# EAGLE schematic OES_Small v10 (EAGLE 9.7.0)
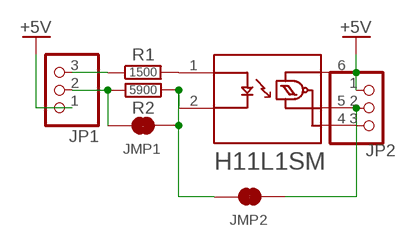
[diagram p0: schematic, sheet 1]

## Parts
JMP1  JUMPER-SMT_2_NC_TRACE_NO-SILK  [SMT-JUMPER_2_NC_TRACE_NO-SILK]
JMP2  JUMPER-SMT_2_NC_TRACE_NO-SILK  [SMT-JUMPER_2_NC_TRACE_NO-SILK]
JP1  PINHD-1X3  [1X03]
JP2  PINHD-1X3  [1X03]
R1  1500  R_CHIP-0402(1005-METRIC)  [RESC1005X40]
R2  5900  R_CHIP-0402(1005-METRIC)  [RESC1005X40]
U1  H11L1SM  [IC_H11L1SM]

## Nets
+5V: JP1.1 JP2.1 U1.6(VCC)
N$1: R1.2 U1.1(A)
N$2: JMP2.1 JP2.2 U1.5(GND)
N$3: JP1.3 R1.1
N$4: JP2.3 U1.4(VO)
N$5: JMP1.1 JMP2.2 R2.1 U1.2(C)
N$6: JMP1.2 JP1.2 R2.2

## Library data of the parts
JMP1 JMP2 = SparkFun-Jumpers:JUMPER-SMT_2_NC_TRACE: Normally closed trace jumper This jumper has a trace between two pads so it's normally closed (NC). Use a razor knife to open the connection. For best results follow the IPC guidelines for cutting traces: Cutout at least 0.063 mm (0.005 in). Remove all loose material to clean up the cut area. Seal the cut with an approved epoxy. Reapply solder to reclose the connection.
JP1 JP2 = pinhead:PINHD-1X3: PIN HEADER
R1 R2 = Resistor:R: Resistor Fixed - Generic; CATEGORY: Resistor; SUB-CATEGORY: Fixed
U1 = H11L1SM:H11L1SM: Logic Output Optocouplers Optocoupler Schmitt Trigger; DESCRIPTION: Logic Output Optoisolator 1MHz Open Collector 4170Vrms 1 Channel CMTI 6-SMD; DIGI-KEY_PART_NUMBER: H11L1SM-ND; MF: ON Semiconductor; MP: H11L1SM; PACKAGE: PDIP-6 ON Semiconductor; PURCHASE-URL: https://pricing.snapeda.com/search/part/H11L1SM/?ref=eda